# EAGLE design Tranca (EAGLE 9.6.2)
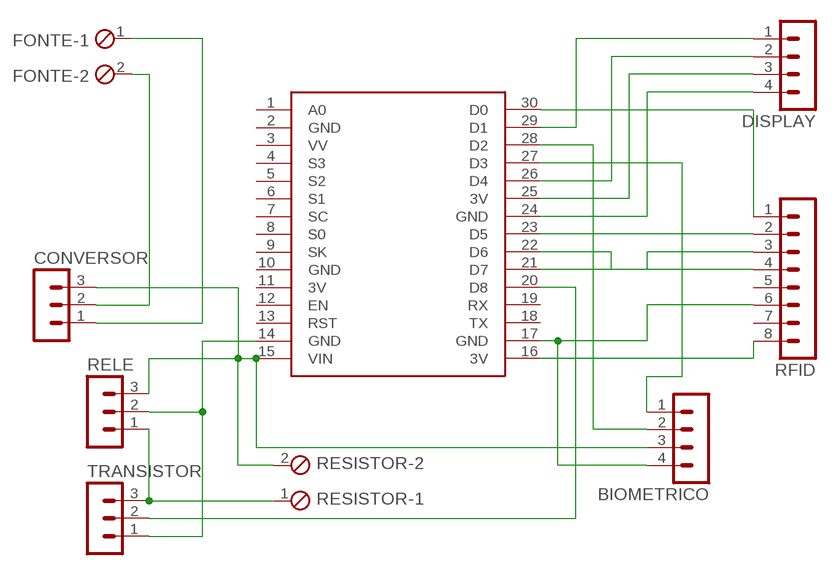
[diagram p0: schematic, sheet 1]

## Parts
BIOMETRICO  MA04-1  [MA04-1]
CONVERSOR  MA03-1  [MA03-1]
DISPLAY  MA04-1  [MA04-1]
FONTE  MPT2  [2POL254]
RELE  MA03-1  [MA03-1]
RESISTOR  MPT2  [2POL254]
RFID  MA08-1  [MA08-1]
TRANSISTOR  MA03-1  [MA03-1]
U$1  NODEMCU  [NODEMCU]

## Nets
N$1: DISPLAY.4 U$1.24(GND)
N$2: DISPLAY.3 U$1.25(3V)
N$3: DISPLAY.2 U$1.26(D4)
N$4: DISPLAY.1 U$1.29(D1)
N$5: TRANSISTOR.2 U$1.20(D8)
N$6: RFID.2 U$1.23(D5)
N$7: RFID.3 U$1.21(D7)
N$8: RFID.4 U$1.22(D6)
N$9: BIOMETRICO.4 RFID.6 U$1.17(GND)
N$10: RELE.2 TRANSISTOR.1 U$1.14(GND)
N$11: RFID.8 U$1.16(3V)
N$12: BIOMETRICO.2 U$1.28(D2)
N$13: BIOMETRICO.1 U$1.27(D3)
N$14: RELE.1 RESISTOR.1 TRANSISTOR.3
N$15: CONVERSOR.2 FONTE.2
N$16: RFID.1 U$1.30(D0)
N$17: CONVERSOR.1 FONTE.1
N$18: BIOMETRICO.3 CONVERSOR.3 RELE.3 RESISTOR.2 U$1.15(VIN)
Unconnected: RFID.5 RFID.7 U$1.1(A0) U$1.3(VV) U$1.4(S3) U$1.5(S2) U$1.6(S1) U$1.7(SC) U$1.8(S0) U$1.9(SK) U$1.12(EN) U$1.13(RST) U$1.18(TX) U$1.19(RX)

## Power pins joined to a net without a drawn wire
3V: U$1.11(3V)
GND: U$1.2(GND) U$1.10(GND)

## Library data of the parts
BIOMETRICO DISPLAY = con-lstb:MA04-1: PIN HEADER; OC_FARNELL: unknown; OC_NEWARK: unknown
CONVERSOR RELE TRANSISTOR = con-lstb:MA03-1: PIN HEADER; OC_FARNELL: unknown; OC_NEWARK: unknown
FONTE RESISTOR = con-phoenix-254:MPT2: PHOENIX CONNECTOR; OC_FARNELL: unknown; OC_NEWARK: unknown
RFID = con-lstb:MA08-1: PIN HEADER; OC_FARNELL: unknown; OC_NEWARK: unknown
U$1 = nodemcu:NODEMCU

## Board
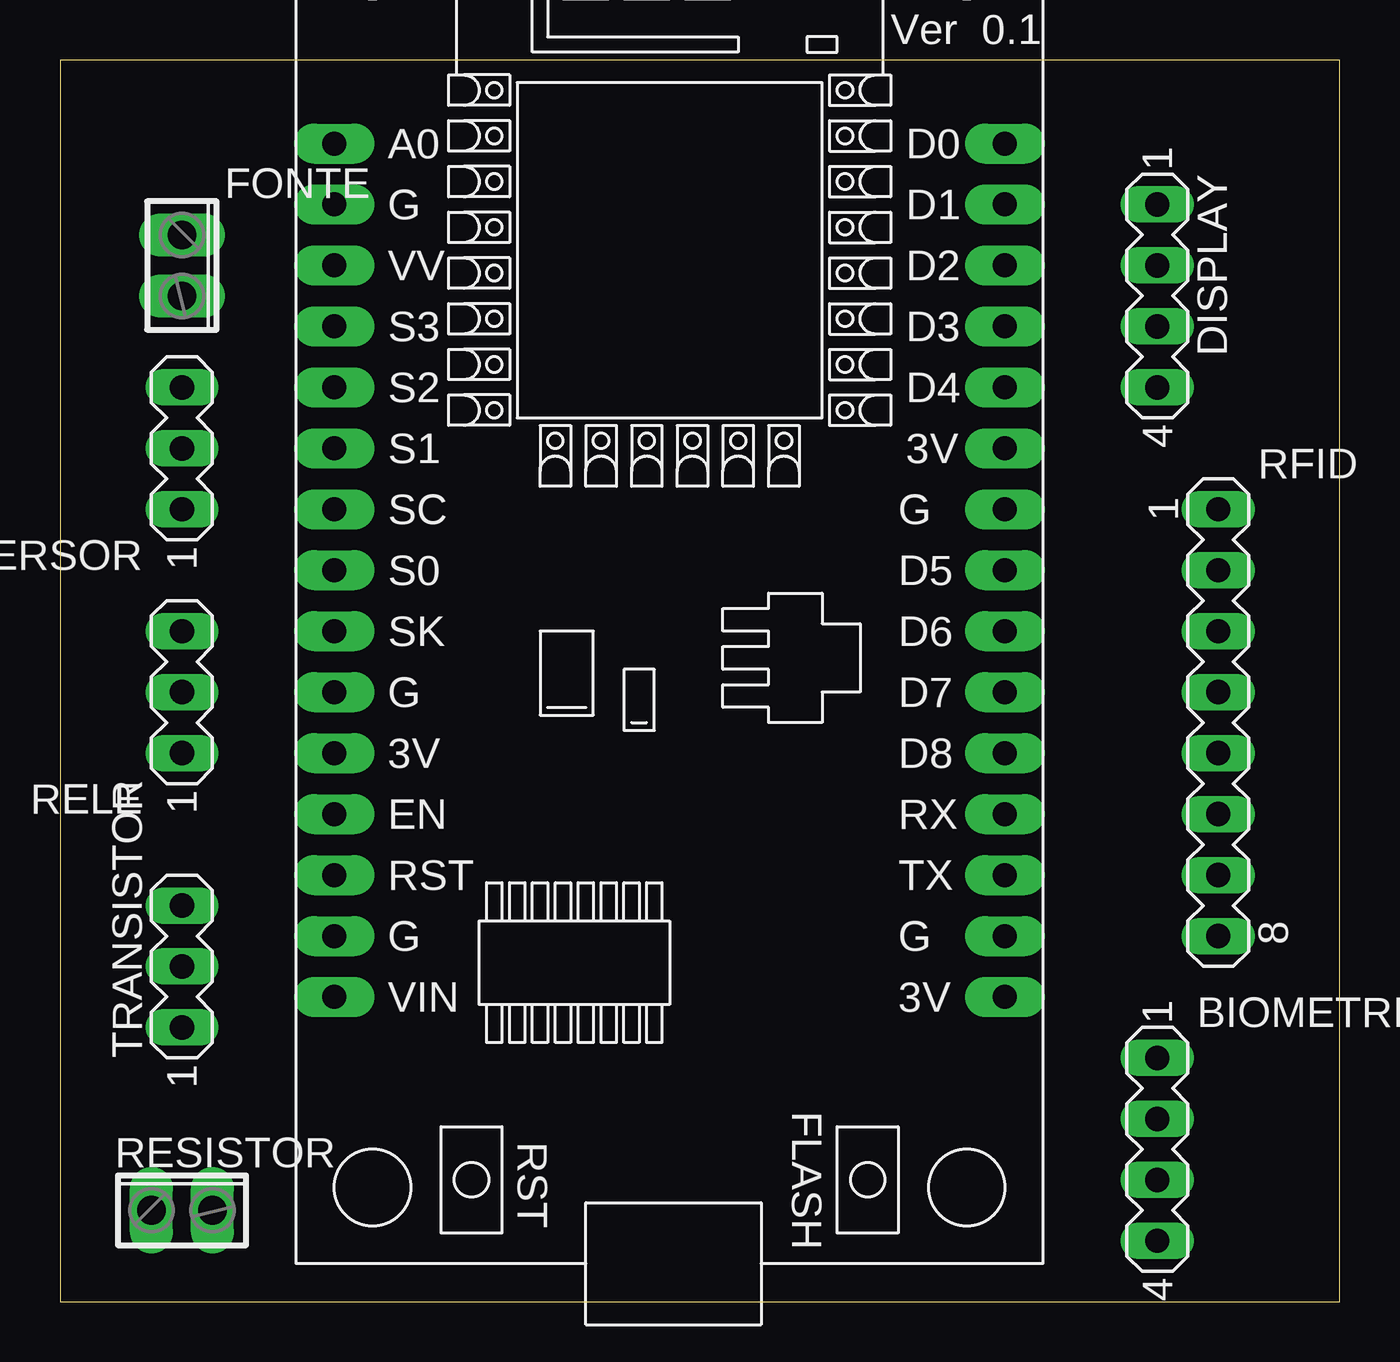
[diagram p1: board, top side]
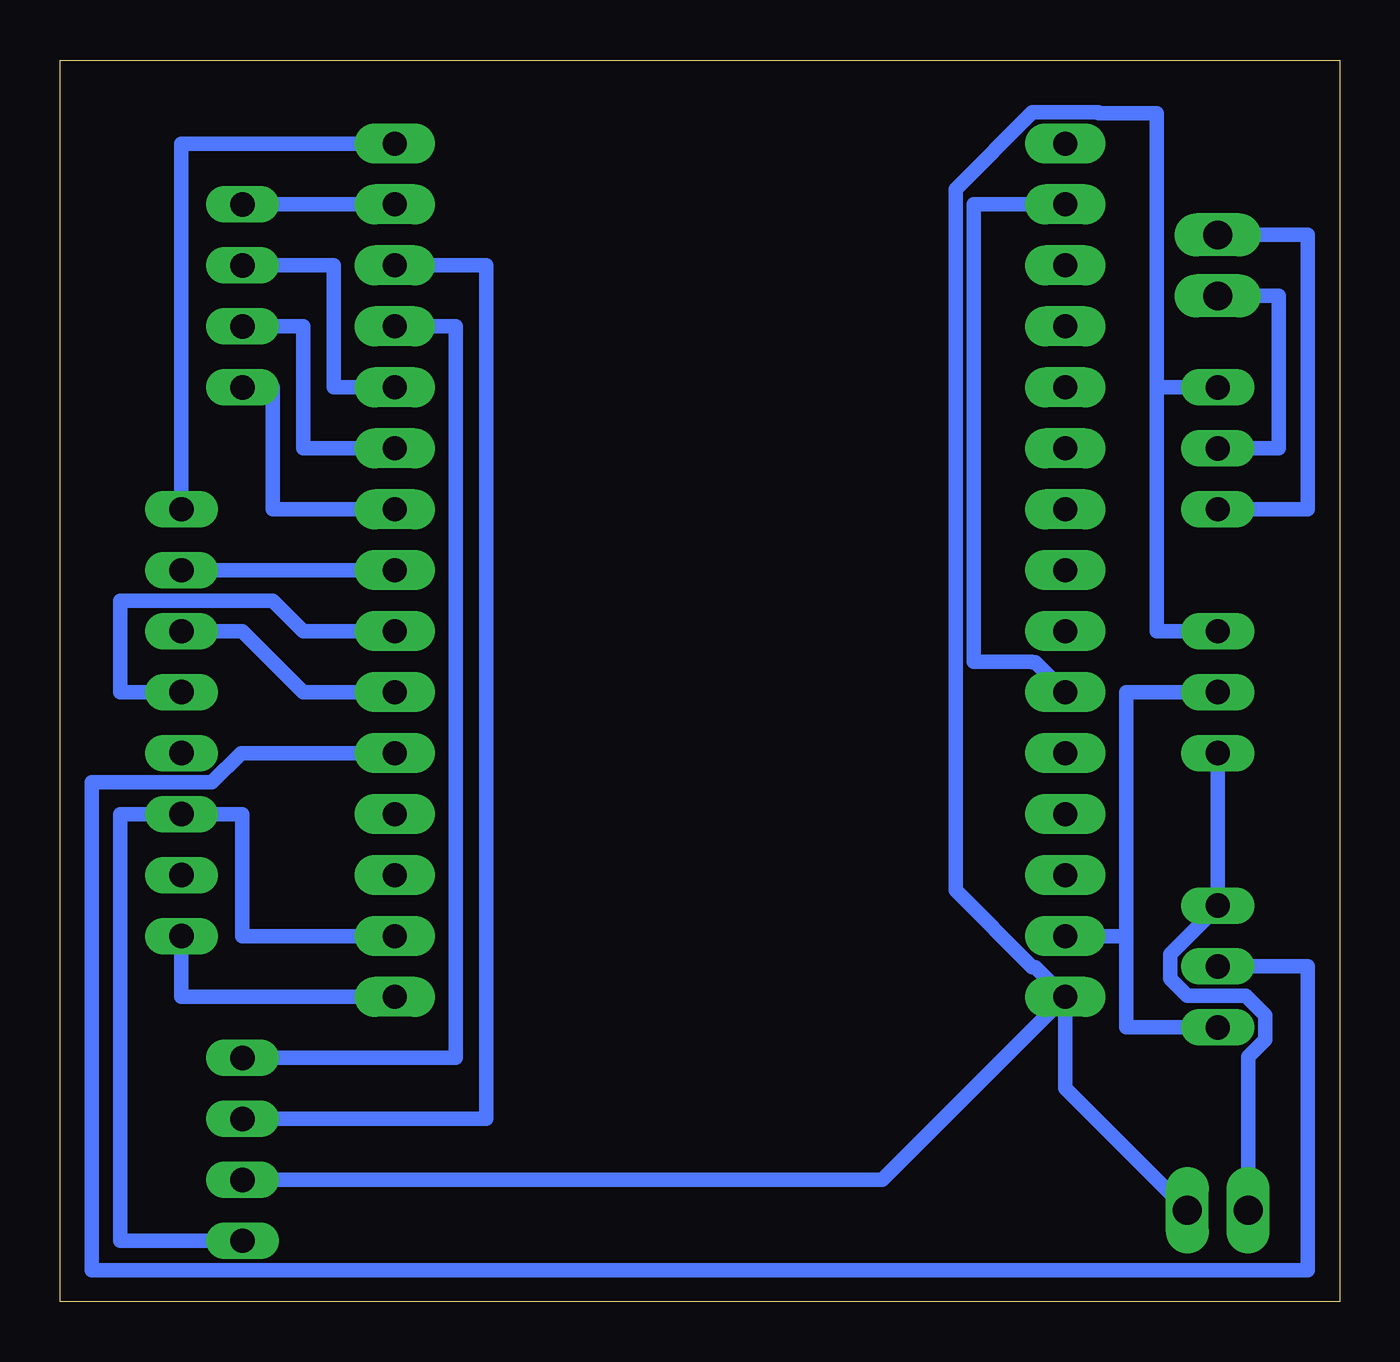
[diagram p2: board, bottom side, seen from below]

Size 53.32 x 51.74 mm. Coordinates in mm from the lower left corner, seen from the top.
Outline: 0,0 53.32,0 53.32,51.74 0,51.74 0,0
Copper layers (1*16): Top 0.035mm / dielectric 1.5mm / Bottom 0.035mm
Design rules "default": minimum track width 6mil, minimum drill 0.35mm, track to track 6mil, track to pad 6mil, pad to pad 6mil, via to via 6mil, smd to smd 6mil, copper to edge 40mil, drill to drill 6mil, minimum pad ring 10mil, minimum via ring 8mil, stop-mask expansion 4mil, vias tented up to drill 0mil, thermal gap 10mil

### Footprints (pad centres in the part's own frame; a part is rotated, then mirrored left to right if it is on the bottom)
MA04-1 = drill 1.016 long: 1 -3.81,0; 2 -1.27,0; 3 1.27,0; 4 3.81,0
MA03-1 = drill 1.016 long: 1 -2.54,0; 2 0,0; 3 2.54,0
2POL254 = drill 1.2 long: 1 -1.27,0; 2 1.27,0
MA08-1 = drill 1.016 long: 1 -8.89,0; 2 -6.35,0; 3 -3.81,0; 4 -1.27,0; 5 1.27,0; 6 3.81,0; 7 6.35,0; 8 8.89,0
NODEMCU = drill 1 pad 1.676 long: 1 -13.97,17.78; 2 -13.97,15.24; 3 -13.97,12.7; 4 -13.97,10.16; 5 -13.97,7.62; 6 -13.97,5.08; 7 -13.97,2.54; 8 -13.97,0; 9 -13.97,-2.54; 10 -13.97,-5.08; 11 -13.97,-7.62; 12 -13.97,-10.16; 13 -13.97,-12.7; 14 -13.97,-15.24; 15 -13.97,-17.78; 16 13.97,-17.78; 17 13.97,-15.24; 18 13.97,-12.7; 19 13.97,-10.16; 20 13.97,-7.62; 21 13.97,-5.08; 22 13.97,-2.54; 23 13.97,0; 24 13.97,2.54; 25 13.97,5.08; 26 13.97,7.62; 27 13.97,10.16; 28 13.97,12.7; 29 13.97,15.24; 30 13.97,17.78

### Placement (x,y rotation side)
BIOMETRICO  45.72,6.35 270 top
CONVERSOR  5.08,35.56 90 top
DISPLAY  45.72,41.91 270 top
FONTE  5.08,43.18 270 top
RELE  5.08,25.4 90 top
RESISTOR  5.08,3.81 0 top
RFID  48.26,24.13 270 top
TRANSISTOR  5.08,13.97 90 top
U$1  25.4,30.48 0 top

### Tracks (layer width: path | path; a pad name or v marks a point on that pad's centre or on a via)
GND
  Bottom 0.61: U$1.10 12.68,26.65 12.81,26.65 12.83,26.67 15.24,26.67 15.24,45.72 U$1.2
N$1
  Bottom 0.61: U$1.24 44.45,33.02 44.45,38.1 DISPLAY.4
N$2
  Bottom 0.61: U$1.25 43.18,35.56 43.18,40.64 DISPLAY.3
N$3
  Bottom 0.61: U$1.26 41.91,38.1 41.91,43.18 DISPLAY.2
N$4
  Bottom 0.61: DISPLAY.1 U$1.29
N$5
  Bottom 0.61: TRANSISTOR.2 1.32,13.97 1.32,1.32 52,1.32 52,21.64 46.99,21.64 45.77,22.86 U$1.20
N$6
  Bottom 0.61: 46.99,30.48 RFID.2 U$1.23
N$7
  Bottom 0.61: RFID.3 45.72,27.94 43.18,25.4 U$1.21
N$8
  Bottom 0.61: RFID.4 50.8,25.4 50.8,29.21 44.45,29.21 43.18,27.94 U$1.22
N$9
  Bottom 0.61: 40.64,15.24 U$1.17 45.72,15.24 45.72,20.32 RFID.6 50.8,20.32 50.8,2.54 BIOMETRICO.4
N$10
  Bottom 0.61: RELE.2 8.89,25.4 8.89,15.24 | 8.89,15.24 U$1.14 | TRANSISTOR.1 8.89,11.43 8.89,15.24
N$11
  Bottom 0.61: RFID.8 48.26,12.7 U$1.16
N$12
  Bottom 0.61: BIOMETRICO.2 35.56,7.62 35.56,43.18 U$1.28
N$13
  Bottom 0.61: BIOMETRICO.1 36.83,10.16 36.83,40.64 U$1.27
N$14
  Bottom 0.61: RELE.1 TRANSISTOR.3 5.08,16.46 7.06,14.48 7.06,13.47 6.35,12.75 3.92,12.75 3.1,11.94 3.1,10.93 3.81,10.21 RESISTOR.1
N$15
  Bottom 0.61: FONTE.2 2.54,41.91 2.54,35.56 CONVERSOR.2
N$16
  Bottom 0.61: RFID.1 48.26,48.26 U$1.30
N$17
  Bottom 0.61: FONTE.1 1.32,44.45 1.32,33.02 CONVERSOR.1
N$18
  Bottom 0.61: BIOMETRICO.3 19.05,5.08 U$1.15 | RESISTOR.2 11.43,8.89 U$1.15 | CONVERSOR.3 7.62,38.1 | 7.62,38.1 7.62,27.94 RELE.3 | 7.62,38.1 7.62,49.53 10.03,49.53 10.06,49.55 12.81,49.55 16,46.36 16,17.14 12.81,13.95 12.68,13.95 U$1.15